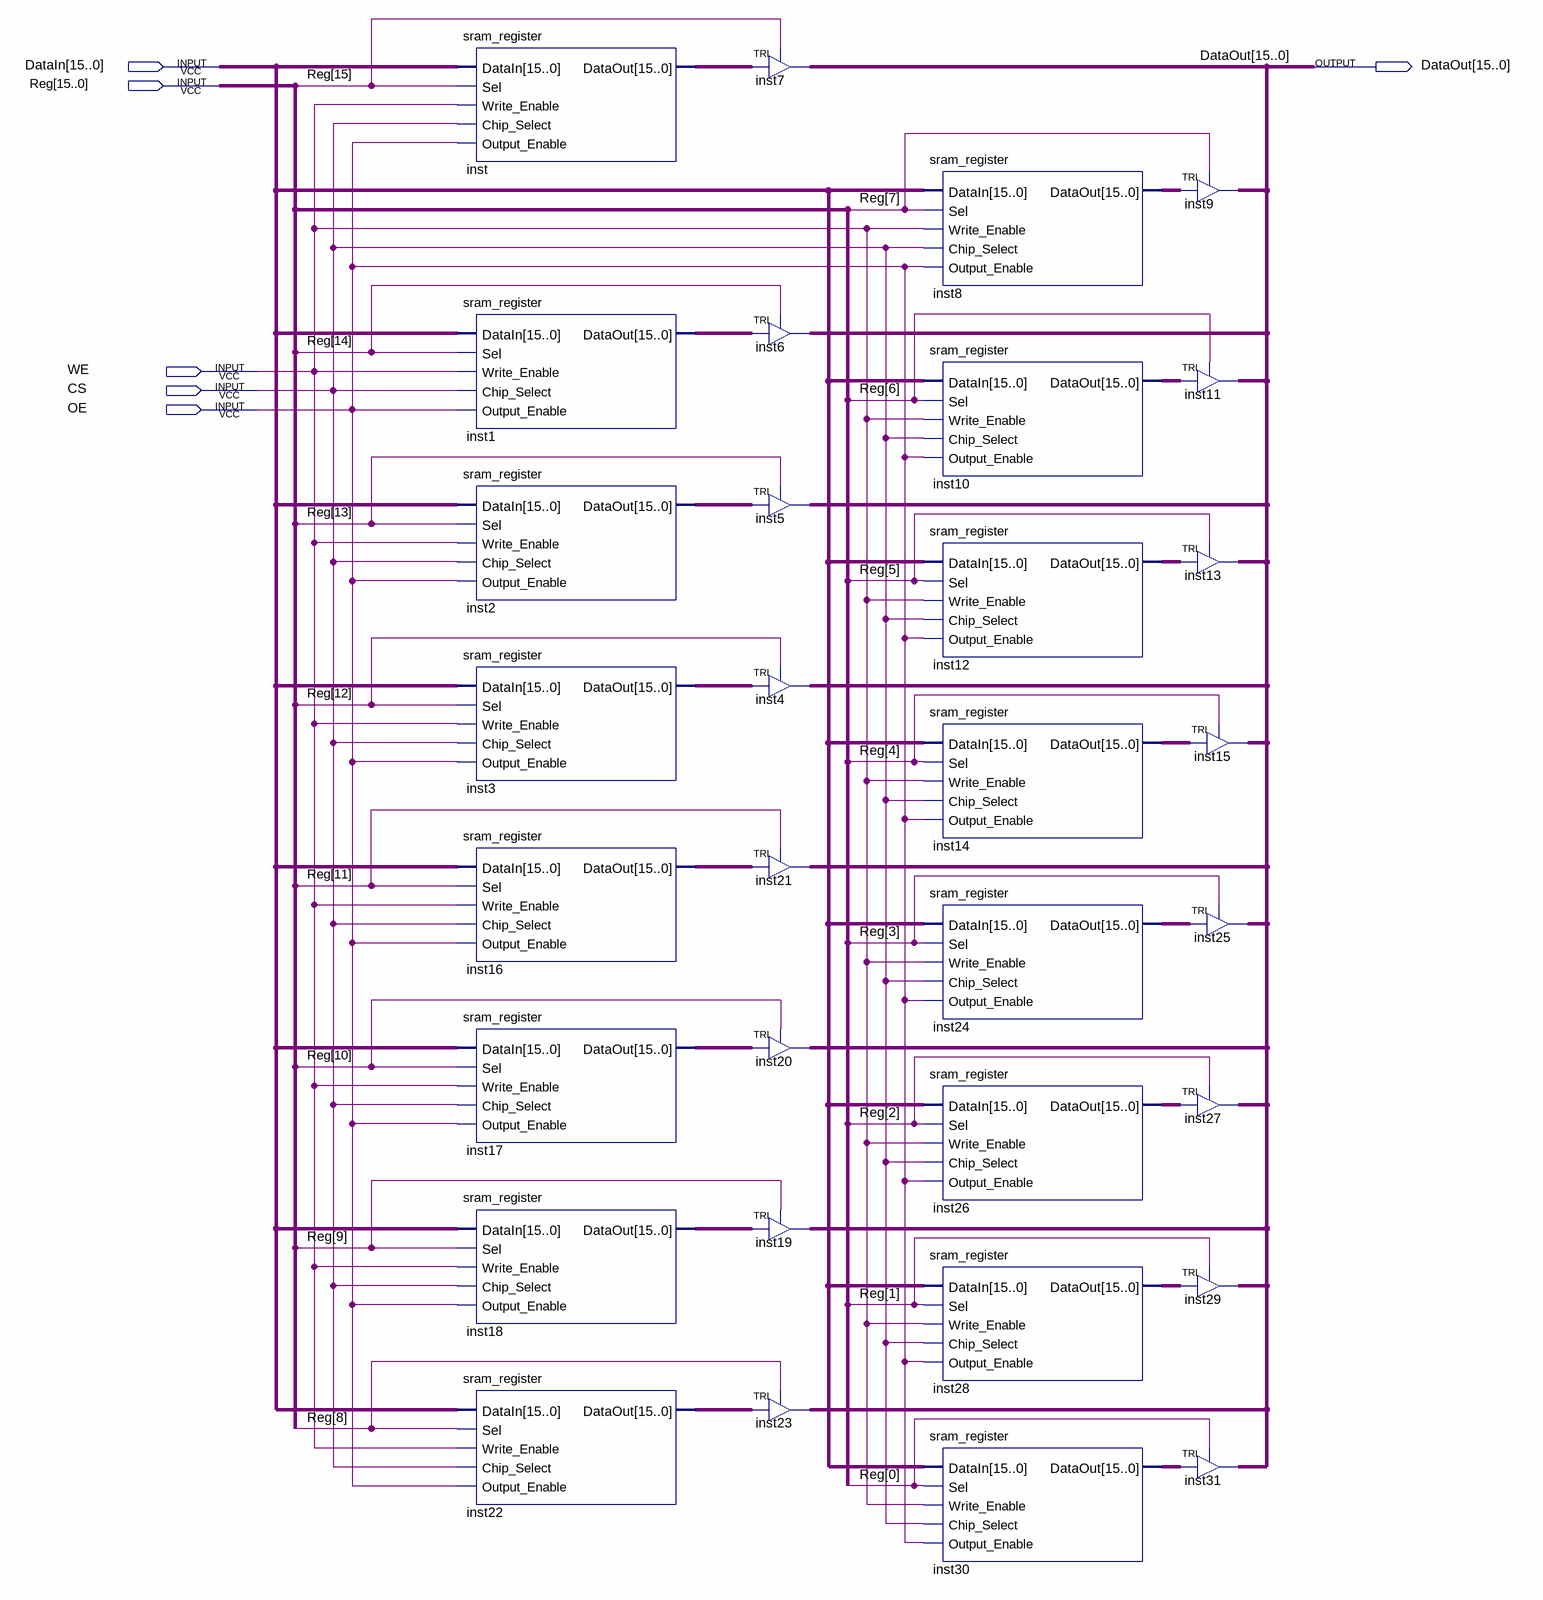
[diagram p0: schematic sheet]
// Quartus schematic sram.bdf as structural Verilog: 32 symbols, 6 pins
module sram (
  input  [15:0] DataIn,
  input  [15:0] Reg,
  input  WE,
  input  CS,
  input  OE,
  output [15:0] DataOut
);

  wire [15:0] inst1_dataout, inst2_dataout, inst3_dataout, inst8_dataout, inst10_dataout, inst12_dataout,
       inst14_dataout, inst16_dataout, inst17_dataout, inst18_dataout, inst22_dataout, inst24_dataout,
       inst26_dataout, inst28_dataout, inst30_dataout, inst_dataout;

  sram_register inst (
    .DataIn(DataIn), .Sel(Reg[15]), .Write_Enable(WE), .Chip_Select(CS), .Output_Enable(OE),
    .DataOut(inst_dataout));
  sram_register inst1 (
    .DataIn(DataIn), .Sel(Reg[14]), .Write_Enable(WE), .Chip_Select(CS), .Output_Enable(OE),
    .DataOut(inst1_dataout));
  sram_register inst2 (
    .DataIn(DataIn), .Sel(Reg[13]), .Write_Enable(WE), .Chip_Select(CS), .Output_Enable(OE),
    .DataOut(inst2_dataout));
  sram_register inst3 (
    .DataIn(DataIn), .Sel(Reg[12]), .Write_Enable(WE), .Chip_Select(CS), .Output_Enable(OE),
    .DataOut(inst3_dataout));
  sram_register inst16 (
    .DataIn(DataIn), .Sel(Reg[11]), .Write_Enable(WE), .Chip_Select(CS), .Output_Enable(OE),
    .DataOut(inst16_dataout));
  sram_register inst17 (
    .DataIn(DataIn), .Sel(Reg[10]), .Write_Enable(WE), .Chip_Select(CS), .Output_Enable(OE),
    .DataOut(inst17_dataout));
  sram_register inst18 (
    .DataIn(DataIn), .Sel(Reg[9]), .Write_Enable(WE), .Chip_Select(CS), .Output_Enable(OE),
    .DataOut(inst18_dataout));
  sram_register inst22 (
    .DataIn(DataIn), .Sel(Reg[8]), .Write_Enable(WE), .Chip_Select(CS), .Output_Enable(OE),
    .DataOut(inst22_dataout));
  TRI inst7[15:0] (.IN(inst_dataout), .OE(Reg[15]), .OUT(DataOut));
  TRI inst6[15:0] (.IN(inst1_dataout), .OE(Reg[14]), .OUT(DataOut));
  TRI inst5[15:0] (.IN(inst2_dataout), .OE(Reg[13]), .OUT(DataOut));
  TRI inst4[15:0] (.IN(inst3_dataout), .OE(Reg[12]), .OUT(DataOut));
  TRI inst21[15:0] (.IN(inst16_dataout), .OE(Reg[11]), .OUT(DataOut));
  TRI inst20[15:0] (.IN(inst17_dataout), .OE(Reg[10]), .OUT(DataOut));
  TRI inst19[15:0] (.IN(inst18_dataout), .OE(Reg[9]), .OUT(DataOut));
  TRI inst23[15:0] (.IN(inst22_dataout), .OE(Reg[8]), .OUT(DataOut));
  sram_register inst8 (
    .DataIn(DataIn), .Sel(Reg[7]), .Write_Enable(WE), .Chip_Select(CS), .Output_Enable(OE),
    .DataOut(inst8_dataout));
  sram_register inst10 (
    .DataIn(DataIn), .Sel(Reg[6]), .Write_Enable(WE), .Chip_Select(CS), .Output_Enable(OE),
    .DataOut(inst10_dataout));
  sram_register inst12 (
    .DataIn(DataIn), .Sel(Reg[5]), .Write_Enable(WE), .Chip_Select(CS), .Output_Enable(OE),
    .DataOut(inst12_dataout));
  sram_register inst14 (
    .DataIn(DataIn), .Sel(Reg[4]), .Write_Enable(WE), .Chip_Select(CS), .Output_Enable(OE),
    .DataOut(inst14_dataout));
  sram_register inst24 (
    .DataIn(DataIn), .Sel(Reg[3]), .Write_Enable(WE), .Chip_Select(CS), .Output_Enable(OE),
    .DataOut(inst24_dataout));
  sram_register inst26 (
    .DataIn(DataIn), .Sel(Reg[2]), .Write_Enable(WE), .Chip_Select(CS), .Output_Enable(OE),
    .DataOut(inst26_dataout));
  sram_register inst28 (
    .DataIn(DataIn), .Sel(Reg[1]), .Write_Enable(WE), .Chip_Select(CS), .Output_Enable(OE),
    .DataOut(inst28_dataout));
  sram_register inst30 (
    .DataIn(DataIn), .Sel(Reg[0]), .Write_Enable(WE), .Chip_Select(CS), .Output_Enable(OE),
    .DataOut(inst30_dataout));
  TRI inst9[15:0] (.IN(inst8_dataout), .OE(Reg[7]), .OUT(DataOut));
  TRI inst11[15:0] (.IN(inst10_dataout), .OE(Reg[6]), .OUT(DataOut));
  TRI inst13[15:0] (.IN(inst12_dataout), .OE(Reg[5]), .OUT(DataOut));
  TRI inst15[15:0] (.IN(inst14_dataout), .OE(Reg[4]), .OUT(DataOut));
  TRI inst25[15:0] (.IN(inst24_dataout), .OE(Reg[3]), .OUT(DataOut));
  TRI inst27[15:0] (.IN(inst26_dataout), .OE(Reg[2]), .OUT(DataOut));
  TRI inst29[15:0] (.IN(inst28_dataout), .OE(Reg[1]), .OUT(DataOut));
  TRI inst31[15:0] (.IN(inst30_dataout), .OE(Reg[0]), .OUT(DataOut));
endmodule
